# EAGLE design SparkFun_MegaShield (EAGLE 7.3.0)
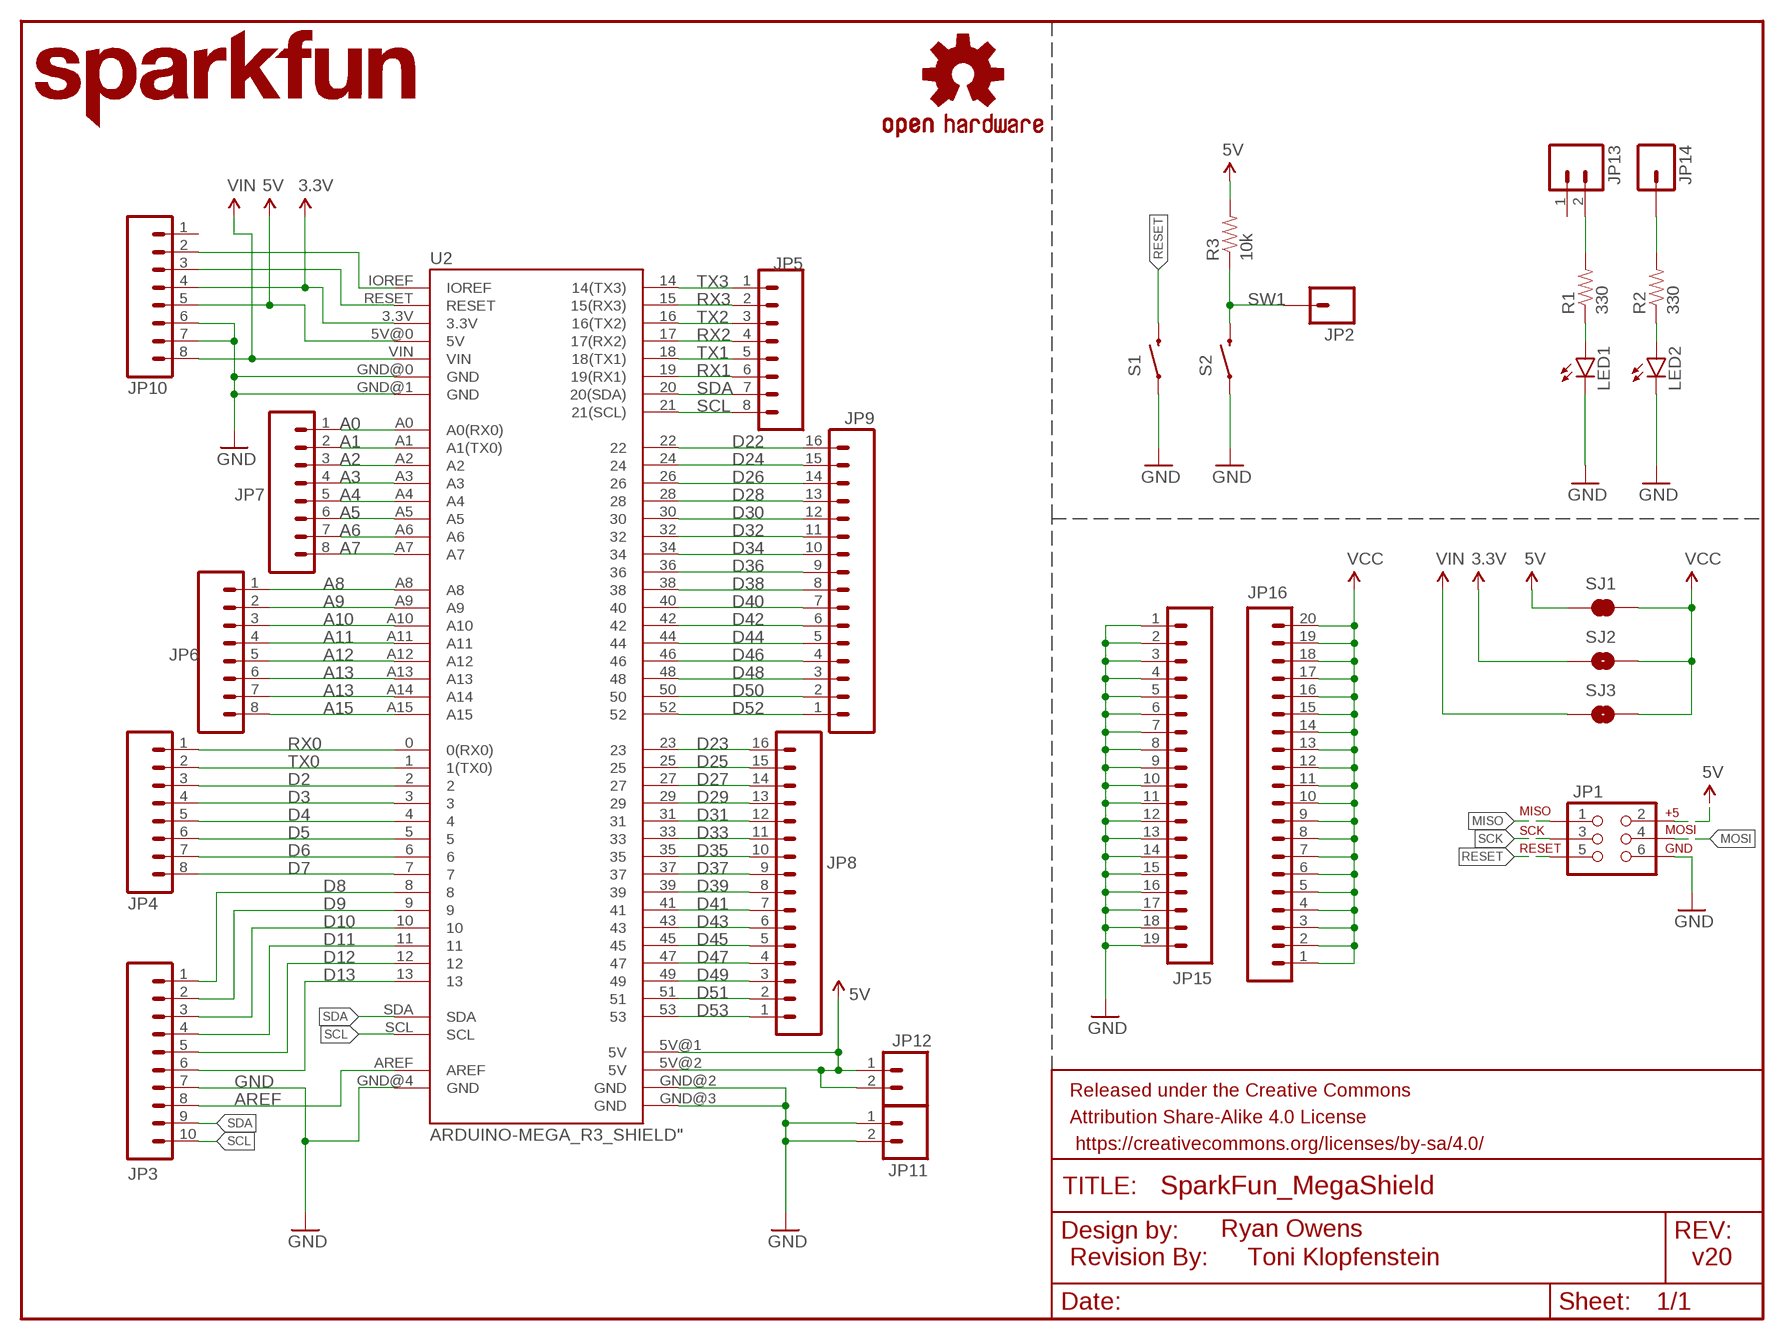
[diagram p0: schematic, sheet 1]

## Parts
FRAME1  FRAME-LETTER  [CREATIVE_COMMONS]
JP1  AVR_SPI_PRG_6PTH  [2X3]
JP2  M01PTH  [1X01]
JP3  M10SILK_FEMALE_PTH  [1X10]
JP4  M08  [1X08_ROUND]
JP5  M08  [1X08_ROUND]
JP6  M08  [1X08_ROUND]
JP7  M08  [1X08_ROUND]
JP8  M16PTH  [1X16]
JP9  M16PTH  [1X16]
JP10  M08  [1X08_ROUND]
JP11  M02PTH  [1X02]
JP12  M02PTH  [1X02]
JP13  M02PTH  [1X02]
JP14  M01PTH  [1X01]
JP15  M191X19  [1X19]
JP16  M20  [1X20]
LED1  Red  LED3MM  [LED3MM]
LED2  Green  LED3MM  [LED3MM]
LOGO1  OSHW-LOGOS  [OSHW-LOGO-S]
LOGO2  SFE_LOGO_NAME.1_INCH  [SFE_LOGO_NAME_.1]
R1  330  RESISTORPTH1  [AXIAL-0.3]
R2  330  RESISTORPTH1  [AXIAL-0.3]
R3  10k  RESISTORPTH1  [AXIAL-0.3]
S1  SWITCH-MOMENTARY-2PTH  [TACTILE-PTH]
S2  SWITCH-MOMENTARY-2PTH  [TACTILE-PTH]
SJ1  JUMPER-PAD-2-NC_BY_TRACE  [PAD-JUMPER-2-NC_BY_TRACE_YES_SILK]
SJ2  JUMPER-PAD-2-NOYES_SILK  [PAD-JUMPER-2-NO_YES_SILK]
SJ3  JUMPER-PAD-2-NOYES_SILK  [PAD-JUMPER-2-NO_YES_SILK]
U2  ARDUINO-MEGA_R3_SHIELD"  [ARDUINO_MEGA_R3_OUTLINE]
U$3  REVISION  [REVISION]

## Nets
3.3V: JP10.4 SJ2.1 U2.3.3V
5V: JP1.2 JP10.5 JP12.1 JP12.2 R3.P$2 SJ1.1 U2.5V@0(5V) U2.5V@1(5V) U2.5V@2(5V)
A0: JP7.1 U2.A0(A0(RX0))
A1: JP7.2 U2.A1(A1(TX0))
A2: JP7.3 U2.A2
A3: JP7.4 U2.A3
A4: JP7.5 U2.A4
A5: JP7.6 U2.A5
A6: JP7.7 U2.A6
A7: JP7.8 U2.A7
A8: JP6.1 U2.A8
A9: JP6.2 U2.A9
A10: JP6.3 U2.A10
A11: JP6.4 U2.A11
A12: JP6.5 U2.A12
A13: JP6.6 U2.A13
A14: JP6.7 U2.A14
A15: JP6.8 U2.A15
AREF: JP3.8 U2.AREF
D2: JP4.3 U2.2
D3: JP4.4 U2.3
D4: JP4.5 U2.4
D5: JP4.6 U2.5
D6: JP4.7 U2.6
D7: JP4.8 U2.7
D8: JP3.1 U2.8
D9: JP3.2 U2.9
D10: JP3.3 U2.10
D11: JP3.4 U2.11
D12: JP3.5 U2.12
D13: JP3.6 U2.13
D22: JP9.16 U2.22
D23: JP8.16 U2.23
D24: JP9.15 U2.24
D25: JP8.15 U2.25
D26: JP9.14 U2.26
D27: JP8.14 U2.27
D28: JP9.13 U2.28
D29: JP8.13 U2.29
D30: JP9.12 U2.30
D31: JP8.12 U2.31
D32: JP9.11 U2.32
D33: JP8.11 U2.33
D34: JP9.10 U2.34
D35: JP8.10 U2.35
D36: JP9.9 U2.36
D37: JP8.9 U2.37
D38: JP9.8 U2.38
D39: JP8.8 U2.39
D40: JP9.7 U2.40
D41: JP8.7 U2.41
D42: JP9.6 U2.42
D43: JP8.6 U2.43
D44: JP9.5 U2.44
D45: JP8.5 U2.45
D46: JP9.4 U2.46
D47: JP8.4 U2.47
D48: JP9.3 U2.48
D49: JP8.3 U2.49
D50: JP9.2 U2.50
D51: JP8.2 U2.51
D52: JP9.1 U2.52
D53: JP8.1 U2.53
GND: JP1.6 JP3.7 JP10.6 JP10.7 JP11.1 JP11.2 JP15.1 JP15.2 JP15.3 JP15.4 JP15.5 JP15.6 JP15.7 JP15.8 JP15.9 JP15.10 JP15.11 JP15.12 JP15.13 JP15.14 JP15.15 JP15.16 JP15.17 JP15.18 JP15.19 LED1.K(C) LED2.K(C) S1.1 S2.1 U2.GND@0(GND) U2.GND@1(GND) U2.GND@2(GND) U2.GND@3(GND) U2.GND@4(GND)
MISO: JP1.1
MOSI: JP1.4
N$126: LED1.A R1.P$1
N$127: LED2.A R2.P$1
N$205: JP10.2 U2.IOREF
N$245: JP13.2 R1.P$2
N$250: JP14.1 R2.P$2
RESET: JP1.5 JP10.3 S1.3 U2.RESET
RX0: JP4.1 U2.0(0(RX0))
RX1: JP5.6 U2.19(19(RX1))
RX2: JP5.4 U2.17(17(RX2))
RX3: JP5.2 U2.15(15(RX3))
SCK: JP1.3
SCL: JP3.10 JP5.8 U2.21(21(SCL)) U2.SCL
SDA: JP3.9 JP5.7 U2.20(20(SDA)) U2.SDA
SW1: JP2.1 R3.P$1 S2.3
TX0: JP4.2 U2.1(1(TX0))
TX1: JP5.5 U2.18(18(TX1))
TX2: JP5.3 U2.16(16(TX2))
TX3: JP5.1 U2.14(14(TX3))
VCC: JP16.1 JP16.2 JP16.3 JP16.4 JP16.5 JP16.6 JP16.7 JP16.8 JP16.9 JP16.10 JP16.11 JP16.12 JP16.13 JP16.14 JP16.15 JP16.16 JP16.17 JP16.18 JP16.19 JP16.20 SJ1.2 SJ2.2 SJ3.2
VIN: JP10.8 SJ3.1 U2.VIN
Unconnected: JP10.1 JP13.1

## Notes on the sheet
- Ryan Owens
- Toni Klopfenstein | v20

## Library data of the parts
FRAME1 = SparkFun-Aesthetics:FRAME-LETTER: Schematic Frame Standard 8.5x11 US Letter frame
JP1 = SparkFun-Connectors:AVR_SPI_PRG_6: AVR ISP 6 Pin This is the reduced ISP connector for AVR programming. Common on Arduino. This footprint will take up less PCB space and can be used with a 10-pin to 6-pin adapter such as SKU: BOB-08508 **Special note about "TEST_POINT" package. The stop mask is on the top side, so if you want your programming test points to be on the bottom of your board, make sure to place this package on the bottom side of the board. This also ensure that the orientation to program from the bottom side will be correct.
JP2 JP14 = SparkFun-Connectors:M01: Header 1 Standard 1-pin 0.1" header. Use with straight break away headers (SKU : PRT-00116), right angle break away headers (PRT-00553), swiss pins (PRT-00743), machine pins (PRT-00117), and female headers (PRT-00115).
JP3 = SparkFun-Connectors:M10: Header 10 Standard 10-pin 0.1" header. Use with straight break away headers (SKU : PRT-00116), right angle break away headers (PRT-00553), swiss pins (PRT-00743), machine pins (PRT-00117), and female headers (PRT-00115).; PROD_ID: CONN-11563
JP4-JP7 JP10 = SparkFun-Connectors:M08: Header 8 Standard 8-pin 0.1" header. Use with straight break away headers (SKU : PRT-00116), right angle break away headers (PRT-00553), swiss pins (PRT-00743), machine pins (PRT-00117), and female headers (PRT-00115).
JP8 JP9 = SparkFun-Connectors:M16: 1x16 .1" header
JP11-JP13 = SparkFun-Connectors:M02: Standard 2-pin 0.1" header. Use with - straight break away headers ( PRT-00116) - right angle break away headers (PRT-00553) - swiss pins (PRT-00743) - machine pins (PRT-00117) - female headers (PRT-00115) Molex polarized connector foot print use with: PRT-08233 with associated crimp pins and housings. 2.54_SCREWTERM for use with PRT-10571. 3.5mm Screw Terminal footprints for PRT-08084 5mm Screw Terminal footprints for use with PRT-08432
JP15 = SparkFun-Connectors:M19: 1x19 .1" header
JP16 = MegaProtoShield:M20: 1x20 .1" header This is just like the LOCK variant in that the holes are staggared by 5 mil, but except for the last two holes. They are not altered from the "standard" footprint layout. This is used for a special purpose on the layout of our Graphic LCD Backpack. Make sure you want to use this device before selecting it for you project!
LED1 LED2 = SparkFun-LED:LED: LEDs Standard schematic elements and footprints for 5mm, 3mm, 1206, and 0603 sized LEDs. 5mm - Spark Fun Electronics SKU : COM-00529 (and others)
LOGO1 = SparkFun-Aesthetics:OSHW-LOGO: Open Source Hardware Logo This logo indicates the piece of hardware it is found on incorporates a OSHW license and/or adheres to the definition of open source hardware found here: http://freedomdefined.org/OSHW
LOGO2 = SparkFun-Aesthetics:SFE_LOGO_NAME: SFE Logo, name only This is the SparkFun name logo. The logo on the schematic will always be the same size; the package variant is the height of the flame part of the logo (or the height the flame would be, if it were drawn). Default layer for the logo on the board is tSilk.
R1-R3 = SparkFun:RESISTOR: Resistor Basic schematic elements and footprints for 0603, 1206, and PTH 1/10th watt (small) resistors.
S1 S2 = SparkFun-Electromechanical:SWITCH-MOMENTARY-2: Various NO switches- pushbuttons, reed, etc; PROD_ID: SWCH-08441
SJ1 = SparkFun-Passives:JUMPER-PAD-2-NC_BY_TRACE
SJ2 SJ3 = SparkFun-Passives:JUMPER-PAD-2-NO
U2 = MegaProtoShield:ARDUINO-MEGA_R3_SHIELD: Arduino Mega board footprint
U$3 = SparkFun-Aesthetics:REVISION

## Board
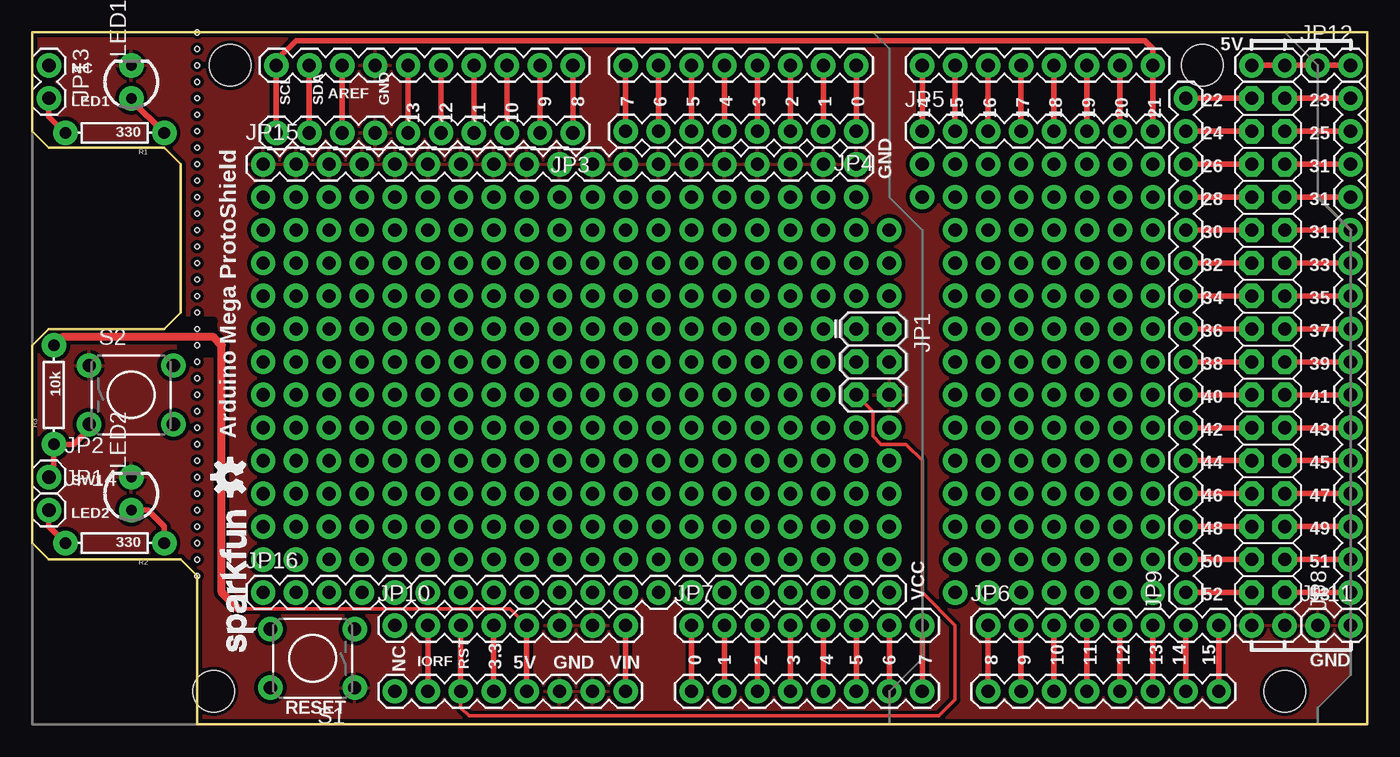
[diagram p1: board, top side]
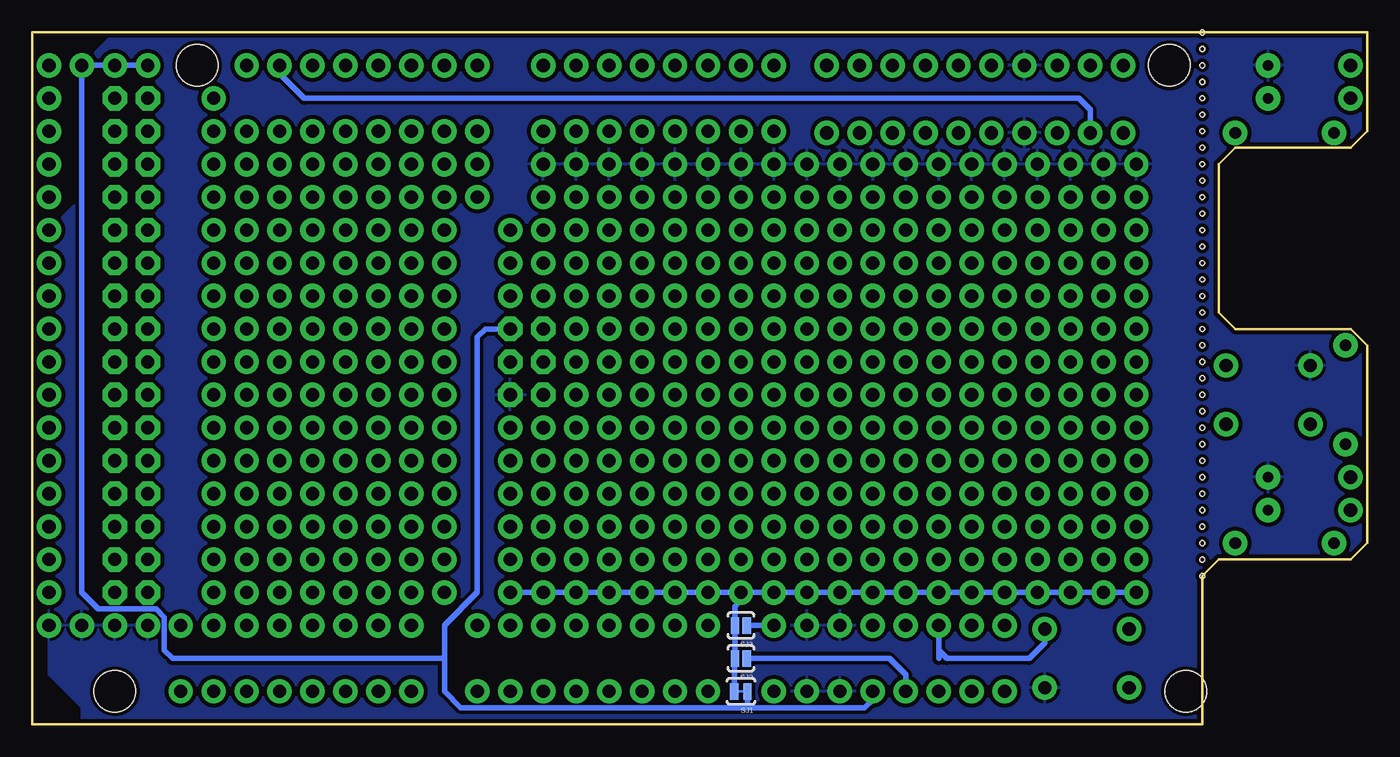
[diagram p2: board, bottom side, seen from below]

Size 102.87 x 53.34 mm. Coordinates in mm from the lower left corner, seen from the top.
Outline: 0,53.34 0,45.72 1.27,44.45 10.16,44.45 11.43,43.18 11.43,31.75 10.16,30.48 1.27,30.48 0,29.21 0,13.97 1.27,12.7 11.43,12.7 12.7,11.43 12.7,0 102.87,0 102.87,53.34 0,53.34
Copper layers (1*16): Top 0.035mm / dielectric 1.5mm / Bottom 0.035mm
Design rules "SparkFun": minimum track width 8mil, minimum drill 20mil, track to track 8mil, track to pad 8mil, pad to pad 8mil, via to via 8mil, smd to smd 8mil, copper to edge 10mil, drill to drill 8mil, minimum pad ring 12mil, minimum via ring 10mil, stop-mask expansion 4mil, vias tented up to drill 25mil, thermal gap 10mil
Holes 0.38 mm at 12.7,11.43 12.7,12.7 12.7,13.97 12.7,15.24 12.7,16.51 12.7,17.78 12.7,19.05 12.7,20.32 12.7,21.59 12.7,22.86 12.7,24.13 12.7,25.4 12.7,26.67 12.7,27.94 12.7,27.94 12.7,29.21 12.7,30.48 12.7,31.75 12.7,33.02 12.7,34.29 12.7,35.56 12.7,36.83 12.7,38.1 12.7,39.37 12.7,40.64 12.7,41.91 12.7,43.18 12.7,44.45 12.7,45.72 12.7,46.99 12.7,48.26 12.7,49.53 12.7,50.8 12.7,52.07 12.7,53.34
tRestrict: area 11.4,30.5 to 14,31.1; area 11.4,28.6 to 14,29.2

### Footprints (pad centres in the part's own frame; a part is rotated, then mirrored left to right if it is on the bottom)
2X3 = drill 1.016 pad 1.88 octagon: 1 0,0; 2 0,2.54; 3 2.54,0; 4 2.54,2.54; 5 5.08,0; 6 5.08,2.54
1X01 = drill 1.016 pad 1.88: 1 0,0
1X10 = drill 1.016 pad 1.88: 1 0,0; 2 2.54,0; 3 5.08,0; 4 7.62,0; 5 10.16,0; 6 12.7,0; 7 15.24,0; 8 17.78,0; 9 20.32,0; 10 22.86,0
1X08_ROUND = drill 1.016 pad 1.88: 1 0,0; 2 2.54,0; 3 5.08,0; 4 7.62,0; 5 10.16,0; 6 12.7,0; 7 15.24,0; 8 17.78,0
1X16 = drill 1.016 pad 1.88: 1 0,0; 2 2.54,0; 3 5.08,0; 4 7.62,0; 5 10.16,0; 6 12.7,0; 7 15.24,0; 8 17.78,0; 9 20.32,0; 10 22.86,0; 11 25.4,0; 12 27.94,0; 13 30.48,0; 14 33.02,0; 15 35.56,0; 16 38.1,0
1X02 = drill 1.016 pad 1.88: 1 0,0; 2 2.54,0
1X19 = drill 1.016 pad 1.88: 1 0,0; 2 2.54,0; 3 5.08,0; 4 7.62,0; 5 10.16,0; 6 12.7,0; 7 15.24,0; 8 17.78,0; 9 20.32,0; 10 22.86,0; 11 25.4,0; 12 27.94,0; 13 30.48,0; 14 33.02,0; 15 35.56,0; 16 38.1,0; 17 40.64,0; 18 43.18,0; 19 45.72,0
1X20 = drill 1.016 pad 1.88: 1 0,0; 2 2.54,0; 3 5.08,0; 4 7.62,0; 5 10.16,0; 6 12.7,0; 7 15.24,0; 8 17.78,0; 9 20.32,0; 10 22.86,0; 11 25.4,0; 12 27.94,0; 13 30.48,0; 14 33.02,0; 15 35.56,0; 16 38.1,0; 17 40.64,0; 18 43.18,0; 19 45.72,0; 20 48.26,0
LED3MM = drill 0.813 pad 1.88: A -1.27,0; K 1.27,0
AXIAL-0.3 = drill 0.9 pad 1.88: P$1 -3.81,0; P$2 3.81,0
TACTILE-PTH = drill 1.016 pad 1.88: 1 -3.251,2.261; 2 3.251,2.261; 3 -3.251,-2.261; 4 3.251,-2.261
PAD-JUMPER-2-NC_BY_TRACE_YES_SILK = smd 0.635 x 1.27: 1 -0.508,0; 2 0.508,0
PAD-JUMPER-2-NO_YES_SILK = smd 0.635 x 1.27: 1 -0.45,0; 2 0.45,0
ARDUINO_MEGA_R3_OUTLINE = drill 1.016 pad 1.88: 0 63.5,50.8; 1 60.96,50.8; 2 58.42,50.8; 3 55.88,50.8; 3.3V 35.56,2.54; 4 53.34,50.8; 5 50.8,50.8; 5V@0 38.1,2.54; 5V@1 93.98,50.8; 5V@2 96.52,50.8; 6 48.26,50.8; 7 45.72,50.8; 8 41.656,50.8; 9 39.116,50.8; 10 36.576,50.8; 11 34.036,50.8; 12 31.496,50.8; 13 28.956,50.8; 14 68.58,50.8; 15 71.12,50.8; 16 73.66,50.8; 17 76.2,50.8; 18 78.74,50.8; 19 81.28,50.8; 20 83.82,50.8; 21 86.36,50.8; A0 50.8,2.54; A1 53.34,2.54; A2 55.88,2.54; A3 58.42,2.54; A4 60.96,2.54; A5 63.5,2.54; A6 66.04,2.54; A7 68.58,2.54; A8 73.66,2.54; A9 76.2,2.54; A10 78.74,2.54; A11 81.28,2.54; A12 83.82,2.54; A13 86.36,2.54; A14 88.9,2.54; A15 91.44,2.54; AREF 23.876,50.8; GND@0 40.64,2.54; GND@1 43.18,2.54; GND@2 93.98,7.62; GND@3 96.52,7.62; GND@4 26.416,50.8; IOREF 30.48,2.54; NC 27.94,2.54; RESET 33.02,2.54; SCL 18.796,50.8; SDA 21.336,50.8; VIN 45.72,2.54 | drill 1.016 pad 1.88 octagon: 22 93.98,48.26; 23 96.52,48.26; 24 93.98,45.72; 25 96.52,45.72; 26 93.98,43.18; 27 96.52,43.18; 28 93.98,40.64; 29 96.52,40.64; 30 93.98,38.1; 31 96.52,38.1; 32 93.98,35.56; 33 96.52,35.56; 34 93.98,33.02; 35 96.52,33.02; 36 93.98,30.48; 37 96.52,30.48; 38 93.98,27.94; 39 96.52,27.94; 40 93.98,25.4; 41 96.52,25.4; 42 93.98,22.86; 43 96.52,22.86; 44 93.98,20.32; 45 96.52,20.32; 46 93.98,17.78; 47 96.52,17.78; 48 93.98,15.24; 49 96.52,15.24; 50 93.98,12.7; 51 96.52,12.7; 52 93.98,10.16; 53 96.52,10.16 | hole 3.2: 15.24,50.8; 13.97,2.54; 90.17,50.8; 96.52,2.54

### Placement (x,y rotation side)
FRAME1  18.31,-16.51 0 top  (outside the outline)
JP1  63.5,30.48 270 top
JP2  1.27,19.05 0 top
JP3  41.66,45.59 180 top
JP4  63.5,45.72 180 top
JP5  68.58,45.72 0 top
JP6  73.66,7.62 0 top
JP7  50.8,7.62 0 top
JP8  101.6,10.16 90 top
JP9  88.9,10.16 90 top
JP10  27.94,7.62 0 top
JP11  99.06,7.62 0 top
JP12  99.06,50.8 0 top
JP13  1.27,50.8 270 top
JP14  1.27,16.51 0 top
JP15  17.78,43.18 0 top
JP16  17.78,10.16 0 top
LED1  7.62,49.53 90 top
LED2  7.62,17.78 90 top
LOGO1  15.24,19.05 90 top
LOGO2  17.78,5.08 90 top
R1  6.35,45.59 180 top
R2  6.35,13.97 180 top
R3  1.65,25.4 90 top
S1  21.59,5.08 180 top
S2  7.62,25.4 0 top
SJ1  48.26,2.54 180 bottom
SJ2  48.26,5.08 180 bottom
SJ3  48.26,7.62 180 bottom
U2  0,0 0 top
U$3  30.48,-19.05 0 top  (outside the outline)

### Tracks (layer width: path | path; a pad name or v marks a point on that pad's centre or on a via)
3.3V
  Top 0.406: JP10.4 U2.3.3V
  Bottom 0.406: U2.3.3V 35.56,3.81 36.83,5.08 SJ2.1
5V  (via drill 0.51)
  Top 0.254: JP10.5 36.83,8.89 15.88,8.89
  Top 0.406: JP12.2 JP12.1 U2.5V@2 U2.5V@1 | JP10.5 U2.5V@0
  Top 0.61: 15.88,8.89 14.61,10.16 14.61,29.21 13.97,29.84 2.29,29.84 R3.P$2
  Bottom 0.406: U2.5V@0 38.1,1.91 38.73,1.27 47.62,1.27 | 47.62,1.27 69.85,1.27 71.12,2.54 71.12,5.08 | 71.12,5.08 71.12,7.62 68.58,10.16 68.58,29.84 67.94,30.48 JP1.2 | U2.5V@1 98.42,50.8 99.06,50.16 99.06,10.16 97.79,8.89 93.34,8.89 92.71,8.26 92.71,5.71 92.08,5.08 71.12,5.08 | SJ1.1 47.75,1.4 47.62,1.27
  other vias: 38.1,2.54
A0
  Top 0.406: JP7.1 U2.A0
A1
  Top 0.406: JP7.2 U2.A1
A2
  Top 0.406: JP7.3 U2.A2
A3
  Top 0.406: JP7.4 U2.A3
A4
  Top 0.406: JP7.5 U2.A4
A5
  Top 0.406: JP7.6 U2.A5
A6
  Top 0.406: JP7.7 U2.A6
A7
  Top 0.406: JP7.8 U2.A7
A8
  Top 0.406: JP6.1 U2.A8
A9
  Top 0.406: JP6.2 U2.A9
A10
  Top 0.406: JP6.3 U2.A10
A11
  Top 0.406: JP6.4 U2.A11
A12
  Top 0.406: JP6.5 U2.A12
A13
  Top 0.406: JP6.6 U2.A13
A14
  Top 0.406: JP6.7 U2.A14
A15
  Top 0.406: JP6.8 U2.A15
AREF
  Top 0.406: U2.AREF JP3.8
D2
  Top 0.406: U2.2 JP4.3
D3
  Top 0.406: U2.3 JP4.4
D4
  Top 0.406: U2.4 JP4.5
D5
  Top 0.406: U2.5 JP4.6
D6
  Top 0.406: U2.6 JP4.7
D7
  Top 0.406: U2.7 JP4.8
D8
  Top 0.406: U2.8 JP3.1
D9
  Top 0.406: U2.9 JP3.2
D10
  Top 0.406: U2.10 JP3.3
D11
  Top 0.406: U2.11 JP3.4
D12
  Top 0.406: U2.12 JP3.5
D13
  Top 0.406: U2.13 JP3.6
D22
  Top 0.406: JP9.16 U2.22
D23
  Top 0.406: U2.23 JP8.16
D24
  Top 0.406: JP9.15 U2.24
D25
  Top 0.406: U2.25 JP8.15
D26
  Top 0.406: JP9.14 U2.26
D27
  Top 0.406: U2.27 JP8.14
D28
  Top 0.406: JP9.13 U2.28
D29
  Top 0.406: U2.29 JP8.13
D30
  Top 0.406: JP9.12 U2.30
D31
  Top 0.406: U2.31 JP8.12
D32
  Top 0.406: JP9.11 U2.32
D33
  Top 0.406: U2.33 JP8.11
D34
  Top 0.406: JP9.10 U2.34
D35
  Top 0.406: U2.35 JP8.10
D36
  Top 0.406: JP9.9 U2.36
D37
  Top 0.406: U2.37 JP8.9
D38
  Top 0.406: JP9.8 U2.38
D39
  Top 0.406: U2.39 JP8.8
D40
  Top 0.406: JP9.7 U2.40
D41
  Top 0.406: U2.41 JP8.7
D42
  Top 0.406: JP9.6 U2.42
D43
  Top 0.406: U2.43 JP8.6
D44
  Top 0.406: JP9.5 U2.44
D45
  Top 0.406: U2.45 JP8.5
D46
  Top 0.406: JP9.4 U2.46
D47
  Top 0.406: U2.47 JP8.4
D48
  Top 0.406: JP9.3 U2.48
D49
  Top 0.406: U2.49 JP8.3
D50
  Top 0.406: JP9.2 U2.50
D51
  Top 0.406: U2.51 JP8.2
D52
  Top 0.406: JP9.1 U2.52
D53
  Top 0.406: U2.53 JP8.1
GND
  pour Bottom (isolate 0.305): 0,0 99.06,0 99.06,1.27 101.6,3.81 101.6,38.1 99.06,40.64 99.06,50.8 96.52,53.34 0,53.34 0,2.54
  pour Top (isolate 0.305): 0,0 99.06,0 99.06,1.27 101.6,3.81 101.6,38.1 99.06,40.64 99.06,50.8 96.52,53.34 0,53.34 0,2.54
N$1  (via drill 1.02 pad 1.88)
  other vias: 27.94,12.7
N$2  (via drill 1.02 pad 1.88)
  other vias: 86.36,35.56
N$3  (via drill 1.02 pad 1.88)
  other vias: 86.36,33.02
N$4  (via drill 1.02 pad 1.88)
  other vias: 86.36,30.48
N$5  (via drill 1.02 pad 1.88)
  other vias: 86.36,27.94
N$6  (via drill 1.02 pad 1.88)
  other vias: 86.36,25.4
N$7  (via drill 1.02 pad 1.88)
  other vias: 86.36,22.86
N$8  (via drill 1.02 pad 1.88)
  other vias: 86.36,20.32
N$9  (via drill 1.02 pad 1.88)
  other vias: 86.36,17.78
N$10  (via drill 1.02 pad 1.88)
  other vias: 86.36,15.24
N$11  (via drill 1.02 pad 1.88)
  other vias: 86.36,12.7
N$12  (via drill 1.02 pad 1.88)
  other vias: 30.48,12.7
N$14  (via drill 1.02 pad 1.88)
  other vias: 83.82,35.56
N$15  (via drill 1.02 pad 1.88)
  other vias: 83.82,33.02
N$16  (via drill 1.02 pad 1.88)
  other vias: 83.82,30.48
N$17  (via drill 1.02 pad 1.88)
  other vias: 83.82,27.94
N$18  (via drill 1.02 pad 1.88)
  other vias: 83.82,25.4
N$19  (via drill 1.02 pad 1.88)
  other vias: 83.82,22.86
N$20  (via drill 1.02 pad 1.88)
  other vias: 83.82,20.32
N$21  (via drill 1.02 pad 1.88)
  other vias: 83.82,17.78
N$22  (via drill 1.02 pad 1.88)
  other vias: 83.82,15.24
N$23  (via drill 1.02 pad 1.88)
  other vias: 83.82,12.7
N$26  (via drill 1.02 pad 1.88)
  other vias: 81.28,12.7
N$27  (via drill 1.02 pad 1.88)
  other vias: 81.28,15.24
N$28  (via drill 1.02 pad 1.88)
  other vias: 81.28,17.78
N$29  (via drill 1.02 pad 1.88)
  other vias: 81.28,20.32
N$30  (via drill 1.02 pad 1.88)
  other vias: 81.28,22.86
N$31  (via drill 1.02 pad 1.88)
  other vias: 81.28,25.4
N$32  (via drill 1.02 pad 1.88)
  other vias: 81.28,27.94
N$33  (via drill 1.02 pad 1.88)
  other vias: 81.28,30.48
N$34  (via drill 1.02 pad 1.88)
  other vias: 81.28,33.02
N$35  (via drill 1.02 pad 1.88)
  other vias: 81.28,35.56
N$36  (via drill 1.02 pad 1.88)
  other vias: 83.82,38.1
N$37  (via drill 1.02 pad 1.88)
  other vias: 73.66,38.1
N$38  (via drill 1.02 pad 1.88)
  other vias: 78.74,35.56
N$39  (via drill 1.02 pad 1.88)
  other vias: 78.74,33.02
N$40  (via drill 1.02 pad 1.88)
  other vias: 78.74,30.48
N$41  (via drill 1.02 pad 1.88)
  other vias: 78.74,27.94
N$42  (via drill 1.02 pad 1.88)
  other vias: 78.74,25.4
N$43  (via drill 1.02 pad 1.88)
  other vias: 78.74,22.86
N$44  (via drill 1.02 pad 1.88)
  other vias: 78.74,20.32
N$45  (via drill 1.02 pad 1.88)
  other vias: 78.74,17.78
N$46  (via drill 1.02 pad 1.88)
  other vias: 78.74,15.24
N$47  (via drill 1.02 pad 1.88)
  other vias: 78.74,12.7
N$48  (via drill 1.02 pad 1.88)
  other vias: 71.12,35.56
N$49  (via drill 1.02 pad 1.88)
  other vias: 71.12,33.02
N$50  (via drill 1.02 pad 1.88)
  other vias: 76.2,12.7
N$51  (via drill 1.02 pad 1.88)
  other vias: 76.2,15.24
N$52  (via drill 1.02 pad 1.88)
  other vias: 76.2,17.78
N$53  (via drill 1.02 pad 1.88)
  other vias: 76.2,20.32
N$54  (via drill 1.02 pad 1.88)
  other vias: 76.2,22.86
N$55  (via drill 1.02 pad 1.88)
  other vias: 76.2,25.4
N$56  (via drill 1.02 pad 1.88)
  other vias: 76.2,27.94
N$57  (via drill 1.02 pad 1.88)
  other vias: 76.2,30.48
N$58  (via drill 1.02 pad 1.88)
  other vias: 76.2,33.02
N$59  (via drill 1.02 pad 1.88)
  other vias: 76.2,35.56
N$60  (via drill 1.02 pad 1.88)
  other vias: 71.12,30.48
N$61  (via drill 1.02 pad 1.88)
  other vias: 71.12,27.94
N$62  (via drill 1.02 pad 1.88)
  other vias: 73.66,35.56
N$63  (via drill 1.02 pad 1.88)
  other vias: 73.66,33.02
N$64  (via drill 1.02 pad 1.88)
  other vias: 73.66,30.48
N$65  (via drill 1.02 pad 1.88)
  other vias: 73.66,27.94
N$66  (via drill 1.02 pad 1.88)
  other vias: 73.66,25.4
N$67  (via drill 1.02 pad 1.88)
  other vias: 73.66,22.86
N$68  (via drill 1.02 pad 1.88)
  other vias: 73.66,20.32
N$69  (via drill 1.02 pad 1.88)
  other vias: 73.66,17.78
N$70  (via drill 1.02 pad 1.88)
  other vias: 73.66,15.24
N$71  (via drill 1.02 pad 1.88)
  other vias: 73.66,12.7
N$72  (via drill 1.02 pad 1.88)
  other vias: 71.12,25.4
N$73  (via drill 1.02 pad 1.88)
  other vias: 71.12,22.86
N$74  (via drill 1.02 pad 1.88)
  other vias: 71.12,20.32
N$75  (via drill 1.02 pad 1.88)
  other vias: 71.12,17.78
N$76  (via drill 1.02 pad 1.88)
  other vias: 71.12,15.24
N$77  (via drill 1.02 pad 1.88)
  other vias: 71.12,12.7
N$78  (via drill 1.02 pad 1.88)
  other vias: 71.12,40.64
N$79  (via drill 1.02 pad 1.88)
  other vias: 71.12,10.16
N$80  (via drill 1.02 pad 1.88)
  other vias: 71.12,43.18
N$81  (via drill 1.02 pad 1.88)
  other vias: 71.12,38.1
N$82  (via drill 1.02 pad 1.88)
  other vias: 68.58,43.18
N$83  (via drill 1.02 pad 1.88)
  other vias: 68.58,40.64
N$97  (via drill 1.02 pad 1.88)
  other vias: 63.5,40.64
N$98  (via drill 1.02 pad 1.88)
  other vias: 66.04,12.7
N$99  (via drill 1.02 pad 1.88)
  other vias: 66.04,15.24
N$100  (via drill 1.02 pad 1.88)
  other vias: 66.04,17.78
N$101  (via drill 1.02 pad 1.88)
  other vias: 66.04,20.32
N$102  (via drill 1.02 pad 1.88)
  other vias: 66.04,22.86
N$103  (via drill 1.02 pad 1.88)
  other vias: 60.96,40.64
N$105  (via drill 1.02 pad 1.88)
  other vias: 66.04,38.1
N$106  (via drill 1.02 pad 1.88)
  other vias: 66.04,33.02
N$107  (via drill 1.02 pad 1.88)
  other vias: 63.5,38.1
N$108  (via drill 1.02 pad 1.88)
  other vias: 60.96,38.1
N$110  (via drill 1.02 pad 1.88)
  other vias: 63.5,35.56
N$111  (via drill 1.02 pad 1.88)
  other vias: 63.5,33.02
N$115  (via drill 1.02 pad 1.88)
  other vias: 63.5,22.86
N$116  (via drill 1.02 pad 1.88)
  other vias: 63.5,20.32
N$117  (via drill 1.02 pad 1.88)
  other vias: 63.5,17.78
N$118  (via drill 1.02 pad 1.88)
  other vias: 63.5,15.24
N$119  (via drill 1.02 pad 1.88)
  other vias: 63.5,12.7
N$122  (via drill 1.02 pad 1.88)
  other vias: 60.96,12.7
N$123  (via drill 1.02 pad 1.88)
  other vias: 60.96,15.24
N$124  (via drill 1.02 pad 1.88)
  other vias: 60.96,17.78
N$126
  Top 0.406: LED1.A 7.62,48.13 R1.P$1
N$127
  Top 0.406: LED2.A 8.89,16.51 10.16,15.24 R2.P$1
N$128  (via drill 1.02 pad 1.88)
  other vias: 60.96,20.32
N$129  (via drill 1.02 pad 1.88)
  other vias: 60.96,22.86
N$130  (via drill 1.02 pad 1.88)
  other vias: 60.96,25.4
N$131  (via drill 1.02 pad 1.88)
  other vias: 60.96,27.94
N$132  (via drill 1.02 pad 1.88)
  other vias: 60.96,30.48
N$133  (via drill 1.02 pad 1.88)
  other vias: 60.96,33.02
N$134  (via drill 1.02 pad 1.88)
  other vias: 60.96,35.56
N$137  (via drill 1.02 pad 1.88)
  other vias: 58.42,40.64
N$139  (via drill 1.02 pad 1.88)
  other vias: 58.42,35.56
N$140  (via drill 1.02 pad 1.88)
  other vias: 58.42,33.02
N$141  (via drill 1.02 pad 1.88)
  other vias: 58.42,30.48
N$142  (via drill 1.02 pad 1.88)
  other vias: 58.42,27.94
N$143  (via drill 1.02 pad 1.88)
  other vias: 58.42,25.4
N$144  (via drill 1.02 pad 1.88)
  other vias: 58.42,22.86
N$145  (via drill 1.02 pad 1.88)
  other vias: 58.42,20.32
N$146  (via drill 1.02 pad 1.88)
  other vias: 58.42,17.78
N$147  (via drill 1.02 pad 1.88)
  other vias: 58.42,15.24
N$148  (via drill 1.02 pad 1.88)
  other vias: 58.42,12.7
N$151  (via drill 1.02 pad 1.88)
  other vias: 55.88,12.7
N$152  (via drill 1.02 pad 1.88)
  other vias: 55.88,15.24
N$153  (via drill 1.02 pad 1.88)
  other vias: 55.88,17.78
N$154  (via drill 1.02 pad 1.88)
  other vias: 55.88,20.32
N$155  (via drill 1.02 pad 1.88)
  other vias: 55.88,22.86
N$156  (via drill 1.02 pad 1.88)
  other vias: 55.88,25.4
N$157  (via drill 1.02 pad 1.88)
  other vias: 55.88,27.94
N$158  (via drill 1.02 pad 1.88)
  other vias: 55.88,30.48
N$159  (via drill 1.02 pad 1.88)
  other vias: 55.88,33.02
N$160  (via drill 1.02 pad 1.88)
  other vias: 55.88,35.56
N$162  (via drill 1.02 pad 1.88)
  other vias: 55.88,40.64
N$165  (via drill 1.02 pad 1.88)
  other vias: 53.34,40.64
N$167  (via drill 1.02 pad 1.88)
  other vias: 53.34,35.56
N$168  (via drill 1.02 pad 1.88)
  other vias: 53.34,33.02
N$169  (via drill 1.02 pad 1.88)
  other vias: 53.34,30.48
N$170  (via drill 1.02 pad 1.88)
  other vias: 53.34,27.94
N$171  (via drill 1.02 pad 1.88)
  other vias: 53.34,25.4
N$172  (via drill 1.02 pad 1.88)
  other vias: 53.34,22.86
N$173  (via drill 1.02 pad 1.88)
  other vias: 53.34,20.32
N$174  (via drill 1.02 pad 1.88)
  other vias: 53.34,17.78
N$175  (via drill 1.02 pad 1.88)
  other vias: 53.34,15.24
N$176  (via drill 1.02 pad 1.88)
  other vias: 53.34,12.7
N$179  (via drill 1.02 pad 1.88)
  other vias: 50.8,12.7
N$180  (via drill 1.02 pad 1.88)
  other vias: 50.8,15.24
N$181  (via drill 1.02 pad 1.88)
  other vias: 50.8,17.78
N$182  (via drill 1.02 pad 1.88)
  other vias: 50.8,20.32
N$183  (via drill 1.02 pad 1.88)
  other vias: 50.8,22.86
N$184  (via drill 1.02 pad 1.88)
  other vias: 50.8,25.4
N$185  (via drill 1.02 pad 1.88)
  other vias: 50.8,27.94
N$186  (via drill 1.02 pad 1.88)
  other vias: 50.8,30.48
N$187  (via drill 1.02 pad 1.88)
  other vias: 50.8,33.02
N$188  (via drill 1.02 pad 1.88)
  other vias: 50.8,35.56
N$190  (via drill 1.02 pad 1.88)
  other vias: 50.8,40.64
N$193  (via drill 1.02 pad 1.88)
  other vias: 48.26,40.64
N$195  (via drill 1.02 pad 1.88)
  other vias: 48.26,35.56
N$196  (via drill 1.02 pad 1.88)
  other vias: 48.26,33.02
N$197  (via drill 1.02 pad 1.88)
  other vias: 48.26,30.48
N$198  (via drill 1.02 pad 1.88)
  other vias: 48.26,27.94
N$199  (via drill 1.02 pad 1.88)
  other vias: 48.26,25.4
N$200  (via drill 1.02 pad 1.88)
  other vias: 48.26,22.86
N$201  (via drill 1.02 pad 1.88)
  other vias: 48.26,20.32
N$202  (via drill 1.02 pad 1.88)
  other vias: 48.26,17.78
N$203  (via drill 1.02 pad 1.88)
  other vias: 48.26,15.24
N$204  (via drill 1.02 pad 1.88)
  other vias: 48.26,12.7
N$205
  Top 0.406: JP10.2 U2.IOREF
N$206  (via drill 1.02 pad 1.88)
  other vias: 66.04,35.56
N$207  (via drill 1.02 pad 1.88)
  other vias: 45.72,12.7
N$208  (via drill 1.02 pad 1.88)
  other vias: 45.72,15.24
N$209  (via drill 1.02 pad 1.88)
  other vias: 45.72,17.78
N$210  (via drill 1.02 pad 1.88)
  other vias: 45.72,20.32
N$211  (via drill 1.02 pad 1.88)
  other vias: 45.72,22.86
N$212  (via drill 1.02 pad 1.88)
  other vias: 45.72,25.4
N$213  (via drill 1.02 pad 1.88)
  other vias: 45.72,27.94
N$214  (via drill 1.02 pad 1.88)
  other vias: 45.72,30.48
N$215  (via drill 1.02 pad 1.88)
  other vias: 45.72,33.02
N$216  (via drill 1.02 pad 1.88)
  other vias: 45.72,35.56
N$217  (via drill 1.02 pad 1.88)
  other vias: 22.86,27.94
N$218  (via drill 1.02 pad 1.88)
  other vias: 45.72,40.64
N$221  (via drill 1.02 pad 1.88)
  other vias: 43.18,40.64
N$223  (via drill 1.02 pad 1.88)
  other vias: 43.18,35.56
N$224  (via drill 1.02 pad 1.88)
  other vias: 43.18,33.02
N$225  (via drill 1.02 pad 1.88)
  other vias: 43.18,30.48
N$226  (via drill 1.02 pad 1.88)
  other vias: 43.18,27.94
N$227  (via drill 1.02 pad 1.88)
  other vias: 43.18,25.4
N$228  (via drill 1.02 pad 1.88)
  other vias: 43.18,22.86
N$229  (via drill 1.02 pad 1.88)
  other vias: 43.18,20.32
N$230  (via drill 1.02 pad 1.88)
  other vias: 43.18,17.78
N$231  (via drill 1.02 pad 1.88)
  other vias: 43.18,15.24
N$232  (via drill 1.02 pad 1.88)
  other vias: 43.18,12.7
N$235  (via drill 1.02 pad 1.88)
  other vias: 40.64,12.7
N$236  (via drill 1.02 pad 1.88)
  other vias: 40.64,15.24
N$237  (via drill 1.02 pad 1.88)
  other vias: 40.64,17.78
N$238  (via drill 1.02 pad 1.88)
  other vias: 40.64,20.32
N$239  (via drill 1.02 pad 1.88)
  other vias: 40.64,22.86
N$240  (via drill 1.02 pad 1.88)
  other vias: 40.64,25.4
N$241  (via drill 1.02 pad 1.88)
  other vias: 40.64,27.94
N$242  (via drill 1.02 pad 1.88)
  other vias: 40.64,30.48
N$243  (via drill 1.02 pad 1.88)
  other vias: 40.64,33.02
N$244  (via drill 1.02 pad 1.88)
  other vias: 40.64,35.56
N$245
  Top 0.406: JP13.2 1.27,46.86 R1.P$2
N$246  (via drill 1.02 pad 1.88)
  other vias: 40.64,40.64
N$249  (via drill 1.02 pad 1.88)
  other vias: 38.1,40.64
N$250
  Top 0.406: JP14.1 1.27,15.24 R2.P$2
N$251  (via drill 1.02 pad 1.88)
  other vias: 38.1,35.56
N$252  (via drill 1.02 pad 1.88)
  other vias: 38.1,33.02
N$253  (via drill 1.02 pad 1.88)
  other vias: 38.1,30.48
N$254  (via drill 1.02 pad 1.88)
  other vias: 38.1,27.94
N$255  (via drill 1.02 pad 1.88)
  other vias: 38.1,25.4
N$256  (via drill 1.02 pad 1.88)
  other vias: 38.1,22.86
N$257  (via drill 1.02 pad 1.88)
  other vias: 38.1,20.32
N$258  (via drill 1.02 pad 1.88)
  other vias: 38.1,17.78
N$259  (via drill 1.02 pad 1.88)
  other vias: 38.1,15.24
N$260  (via drill 1.02 pad 1.88)
  other vias: 38.1,12.7
N$263  (via drill 1.02 pad 1.88)
  other vias: 35.56,12.7
N$264  (via drill 1.02 pad 1.88)
  other vias: 35.56,15.24
N$265  (via drill 1.02 pad 1.88)
  other vias: 35.56,17.78
N$266  (via drill 1.02 pad 1.88)
  other vias: 35.56,20.32
N$267  (via drill 1.02 pad 1.88)
  other vias: 35.56,22.86
N$268  (via drill 1.02 pad 1.88)
  other vias: 35.56,25.4
N$269  (via drill 1.02 pad 1.88)
  other vias: 35.56,27.94
N$270  (via drill 1.02 pad 1.88)
  other vias: 35.56,30.48
N$271  (via drill 1.02 pad 1.88)
  other vias: 35.56,33.02
N$272  (via drill 1.02 pad 1.88)
  other vias: 35.56,35.56
N$274  (via drill 1.02 pad 1.88)
  other vias: 35.56,40.64
N$277  (via drill 1.02 pad 1.88)
  other vias: 33.02,40.64
N$279  (via drill 1.02 pad 1.88)
  other vias: 33.02,35.56
N$280  (via drill 1.02 pad 1.88)
  other vias: 33.02,33.02
N$281  (via drill 1.02 pad 1.88)
  other vias: 33.02,30.48
N$282  (via drill 1.02 pad 1.88)
  other vias: 33.02,27.94
N$283  (via drill 1.02 pad 1.88)
  other vias: 33.02,22.86
N$284  (via drill 1.02 pad 1.88)
  other vias: 33.02,25.4
N$285  (via drill 1.02 pad 1.88)
  other vias: 33.02,20.32
N$286  (via drill 1.02 pad 1.88)
  other vias: 33.02,17.78
N$287  (via drill 1.02 pad 1.88)
  other vias: 33.02,15.24
N$288  (via drill 1.02 pad 1.88)
  other vias: 33.02,12.7
N$292  (via drill 1.02 pad 1.88)
  other vias: 30.48,15.24
N$293  (via drill 1.02 pad 1.88)
  other vias: 30.48,17.78
N$294  (via drill 1.02 pad 1.88)
  other vias: 30.48,20.32
N$295  (via drill 1.02 pad 1.88)
  other vias: 30.48,22.86
N$296  (via drill 1.02 pad 1.88)
  other vias: 30.48,25.4
N$297  (via drill 1.02 pad 1.88)
  other vias: 30.48,27.94
N$298  (via drill 1.02 pad 1.88)
  other vias: 30.48,30.48
N$299  (via drill 1.02 pad 1.88)
  other vias: 30.48,33.02
N$300  (via drill 1.02 pad 1.88)
  other vias: 30.48,35.56
N$302  (via drill 1.02 pad 1.88)
  other vias: 30.48,40.64
N$305  (via drill 1.02 pad 1.88)
  other vias: 27.94,40.64
N$307  (via drill 1.02 pad 1.88)
  other vias: 27.94,35.56
N$308  (via drill 1.02 pad 1.88)
  other vias: 27.94,33.02
N$309  (via drill 1.02 pad 1.88)
  other vias: 27.94,30.48
N$310  (via drill 1.02 pad 1.88)
  other vias: 27.94,27.94
N$311  (via drill 1.02 pad 1.88)
  other vias: 27.94,25.4
N$312  (via drill 1.02 pad 1.88)
  other vias: 27.94,20.32
N$313  (via drill 1.02 pad 1.88)
  other vias: 27.94,15.24
N$324  (via drill 1.02 pad 1.88)
  other vias: 27.94,17.78
N$325  (via drill 1.02 pad 1.88)
  other vias: 27.94,22.86
N$327  (via drill 1.02 pad 1.88)
  other vias: 25.4,40.64
N$329  (via drill 1.02 pad 1.88)
  other vias: 25.4,35.56
N$330  (via drill 1.02 pad 1.88)
  other vias: 25.4,33.02
N$331  (via drill 1.02 pad 1.88)
  other vias: 25.4,30.48
N$332  (via drill 1.02 pad 1.88)
  other vias: 25.4,27.94
N$333  (via drill 1.02 pad 1.88)
  other vias: 25.4,25.4
N$334  (via drill 1.02 pad 1.88)
  other vias: 25.4,22.86
N$335  (via drill 1.02 pad 1.88)
  other vias: 25.4,20.32
N$336  (via drill 1.02 pad 1.88)
  other vias: 25.4,17.78
N$337  (via drill 1.02 pad 1.88)
  other vias: 25.4,15.24
N$338  (via drill 1.02 pad 1.88)
  other vias: 25.4,12.7
N$343  (via drill 1.02 pad 1.88)
  other vias: 22.86,12.7
N$344  (via drill 1.02 pad 1.88)
  other vias: 22.86,15.24
N$345  (via drill 1.02 pad 1.88)
  other vias: 22.86,17.78
N$346  (via drill 1.02 pad 1.88)
  other vias: 22.86,20.32
N$347  (via drill 1.02 pad 1.88)
  other vias: 22.86,22.86
N$348  (via drill 1.02 pad 1.88)
  other vias: 22.86,25.4
N$350  (via drill 1.02 pad 1.88)
  other vias: 22.86,30.48
N$351  (via drill 1.02 pad 1.88)
  other vias: 22.86,33.02
N$352  (via drill 1.02 pad 1.88)
  other vias: 22.86,35.56
N$354  (via drill 1.02 pad 1.88)
  other vias: 22.86,40.64
N$356  (via drill 1.02 pad 1.88)
  other vias: 55.88,38.1
N$357  (via drill 1.02 pad 1.88)
  other vias: 17.78,38.1
N$360  (via drill 1.02 pad 1.88)
  other vias: 20.32,40.64
N$362  (via drill 1.02 pad 1.88)
  other vias: 20.32,35.56
N$363  (via drill 1.02 pad 1.88)
  other vias: 20.32,33.02
N$364  (via drill 1.02 pad 1.88)
  other vias: 20.32,30.48
N$365  (via drill 1.02 pad 1.88)
  other vias: 20.32,27.94
N$366  (via drill 1.02 pad 1.88)
  other vias: 20.32,22.86
N$367  (via drill 1.02 pad 1.88)
  other vias: 20.32,25.4
N$368  (via drill 1.02 pad 1.88)
  other vias: 20.32,20.32
N$369  (via drill 1.02 pad 1.88)
  other vias: 20.32,17.78
N$370  (via drill 1.02 pad 1.88)
  other vias: 20.32,15.24
N$371  (via drill 1.02 pad 1.88)
  other vias: 20.32,12.7
N$376  (via drill 1.02 pad 1.88)
  other vias: 17.78,12.7
N$377  (via drill 1.02 pad 1.88)
  other vias: 17.78,15.24
N$378  (via drill 1.02 pad 1.88)
  other vias: 17.78,17.78
N$379  (via drill 1.02 pad 1.88)
  other vias: 17.78,20.32
N$380  (via drill 1.02 pad 1.88)
  other vias: 17.78,22.86
N$381  (via drill 1.02 pad 1.88)
  other vias: 17.78,25.4
N$382  (via drill 1.02 pad 1.88)
  other vias: 17.78,27.94
N$383  (via drill 1.02 pad 1.88)
  other vias: 17.78,30.48
N$384  (via drill 1.02 pad 1.88)
  other vias: 17.78,33.02
N$385  (via drill 1.02 pad 1.88)
  other vias: 17.78,35.56
N$387  (via drill 1.02 pad 1.88)
  other vias: 17.78,40.64
N$389  (via drill 1.02 pad 1.88)
  other vias: 53.34,38.1
N$395  (via drill 1.02 pad 1.88)
  other vias: 20.32,38.1
N$397  (via drill 1.02 pad 1.88)
  other vias: 25.4,38.1
N$398  (via drill 1.02 pad 1.88)
  other vias: 38.1,38.1
N$399  (via drill 1.02 pad 1.88)
  other vias: 50.8,38.1
N$400  (via drill 1.02 pad 1.88)
  other vias: 73.66,40.64
N$402  (via drill 1.02 pad 1.88)
  other vias: 43.18,38.1
N$403  (via drill 1.02 pad 1.88)
  other vias: 45.72,38.1
N$405  (via drill 1.02 pad 1.88)
  other vias: 33.02,38.1
N$406  (via drill 1.02 pad 1.88)
  other vias: 27.94,38.1
N$407  (via drill 1.02 pad 1.88)
  other vias: 30.48,38.1
N$408  (via drill 1.02 pad 1.88)
  other vias: 35.56,38.1
N$410  (via drill 1.02 pad 1.88)
  other vias: 48.26,38.1
N$412  (via drill 1.02 pad 1.88)
  other vias: 58.42,38.1
N$443  (via drill 1.02 pad 1.88)
  other vias: 73.66,10.16
N$444  (via drill 1.02 pad 1.88)
  other vias: 76.2,43.18
N$445  (via drill 1.02 pad 1.88)
  other vias: 76.2,10.16
N$446  (via drill 1.02 pad 1.88)
  other vias: 78.74,10.16
N$447  (via drill 1.02 pad 1.88)
  other vias: 78.74,43.18
N$448  (via drill 1.02 pad 1.88)
  other vias: 78.74,40.64
N$449  (via drill 1.02 pad 1.88)
  other vias: 81.28,40.64
N$450  (via drill 1.02 pad 1.88)
  other vias: 83.82,40.64
N$451  (via drill 1.02 pad 1.88)
  other vias: 86.36,40.64
N$452  (via drill 1.02 pad 1.88)
  other vias: 81.28,38.1
N$460  (via drill 1.02 pad 1.88)
  other vias: 76.2,38.1
N$461  (via drill 1.02 pad 1.88)
  other vias: 86.36,10.16
N$462  (via drill 1.02 pad 1.88)
  other vias: 83.82,10.16
N$463  (via drill 1.02 pad 1.88)
  other vias: 81.28,10.16
N$464  (via drill 1.02 pad 1.88)
  other vias: 81.28,43.18
N$465  (via drill 1.02 pad 1.88)
  other vias: 83.82,43.18
N$466  (via drill 1.02 pad 1.88)
  other vias: 78.74,38.1
N$467  (via drill 1.02 pad 1.88)
  other vias: 86.36,43.18
N$493  (via drill 1.02 pad 1.88)
  other vias: 86.36,38.1
N$495  (via drill 1.02 pad 1.88)
  other vias: 40.64,38.1
N$496  (via drill 1.02 pad 1.88)
  other vias: 22.86,38.1
N$500  (via drill 1.02 pad 1.88)
  other vias: 73.66,43.18
N$501  (via drill 1.02 pad 1.88)
  other vias: 76.2,40.64
RESET
  Top 0.254: U2.RESET 33.02,1.27 33.66,0.64 69.85,0.64 71.12,1.91 71.12,7.62 68.58,10.16 68.58,20.32 67.31,21.59 65.41,21.59 64.77,22.23 64.77,24.13 JP1.5
  Top 0.406: JP10.3 U2.RESET
  Bottom 0.406: S1.3 24.84,6.27 26.04,5.08 32.38,5.08 33.02,5.71 | 33.02,5.08 33.02,5.71 | 33.02,5.71 JP10.3
RX0
  Top 0.406: U2.0 JP4.1
RX1
  Top 0.406: U2.19 JP5.6
RX2
  Top 0.406: U2.17 JP5.4
RX3
  Top 0.406: U2.15 JP5.2
SCL
  Top 0.406: JP5.8 U2.21 86.36,52.07 85.72,52.7 20.32,52.7 18.8,51.18 JP3.10 U2.SCL
SDA
  Top 0.406: U2.20 JP5.7 | U2.SDA JP3.9
  Bottom 0.406: JP3.9 21.34,47.37 22.23,48.26 81.92,48.26 83.82,50.16 U2.20
SW1
  Top 0.406: JP2.1 1.65,19.43 R3.P$1 3.17,21.59 4.45,22.86 4.45,23.06 S2.3
TX0
  Top 0.406: U2.1 JP4.2
TX1
  Top 0.406: U2.18 JP5.5
TX2
  Top 0.406: U2.16 JP5.3
TX3
  Top 0.406: U2.14 JP5.1
VCC
  Bottom 0.406: JP16.1 JP16.2 JP16.3 JP16.4 | JP16.4 26.04,10.16 | JP16.4 JP16.5 JP16.6 JP16.7 JP16.8 JP16.9 JP16.10 JP16.11 JP16.12 JP16.13 | JP16.13 JP16.14 JP16.15 JP16.16 JP16.17 JP16.18 JP16.19 JP16.20 | SJ1.2 48.77,5.02 SJ2.2 SJ3.2 48.71,9.07 48.26,9.53 JP16.13
VIN
  Top 0.406: JP10.8 U2.VIN
  Bottom 0.406: SJ3.1 JP10.8

### Text on the board
tPlace: 5V | NC | AREF | LED1 | SCL | SDA | GND | 9 | 8 | 7 | 6 | 5 | 4 | 3 | 2 | 1 | 0 | 22 | 23 | 14 | 15 | 16 | 17 | 18 | 19 | 20 | 21 | 13 | 12 | 11 | 10 | 24 | 25 | 26 | 31 | GND | 28 | 31 | 30 | 31 | 32 | 33 | 34 | 35 | 36 | 37 | 38 | 39 | 40 | 41 | Arduino Mega ProtoShield | 42 | 43 | 44 | 45 | SW1 | 46 | 47 | LED2 | 48 | 49 | 50 | 51 | VCC | 52 | 53 | 0 | 1 | 2 | 3 | 4 | 5 | 6 | 7 | 8 | 9 | 10 | 11 | 12 | 13 | 14 | 15 | NC | IORF | RST | 3.3 | 5V | GND | VIN | GND | RESET